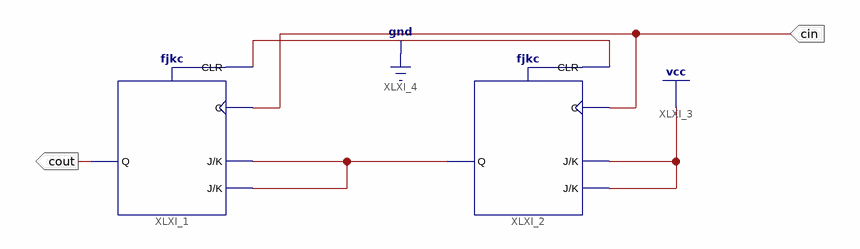
[diagram p0: schematic sheet 1]
// Xilinx ISE schematic Div4.sch (spartan6) as structural Verilog: 2 symbols, 2 ports
module Div4 (
  input  cin,
  output cout
);

  wire XLXN_3;

  fjkc XLXI_1 (.C(cin), .CLR(1'b0), .J(XLXN_3), .K(XLXN_3), .Q(cout));
  fjkc XLXI_2 (.C(cin), .CLR(1'b0), .J(1'b1), .K(1'b1), .Q(XLXN_3));
endmodule
